# EAGLE design indsensor (EAGLE 7.1.0)
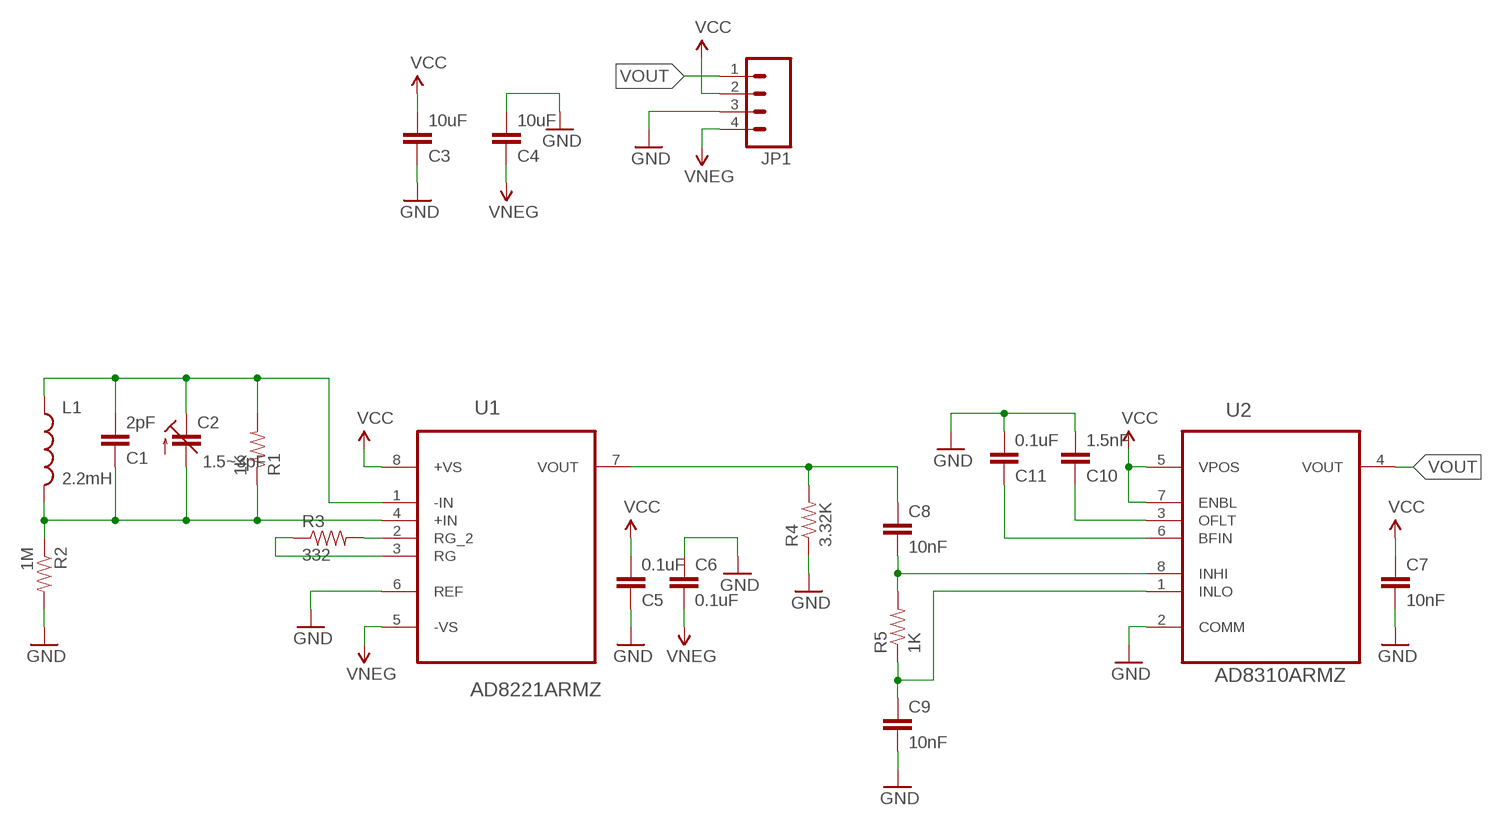
[diagram p0: schematic, sheet 1]

## Parts
C1  2pF  CAP0603-CAP  [0603-CAP]
C2  1.5~3pF  TRIMCAP-TZY  [TRIMCAP-TZY]
C3  10uF  CAP0603-CAP  [0603-CAP]
C4  10uF  CAP0603-CAP  [0603-CAP]
C5  0.1uF  CAP0603-CAP  [0603-CAP]
C6  0.1uF  CAP0603-CAP  [0603-CAP]
C7  10nF  CAP0603-CAP  [0603-CAP]
C8  10nF  CAP0603-CAP  [0603-CAP]
C9  10nF  CAP0603-CAP  [0603-CAP]
C10  1.5nF  CAP0603-CAP  [0603-CAP]
C11  0.1uF  CAP0603-CAP  [0603-CAP]
JP1  M04LOCK  [1X04_LOCK]
L1  2.2mH  LQH43N  [1812]
R1  1K  RESISTOR0603  [0603-RES]
R2  1M  RESISTOR0603  [0603-RES]
R3  332  RESISTOR0603  [0603-RES]
R4  3.32K  RESISTOR0603  [0603-RES]
R5  1K  RESISTOR0603  [0603-RES]
U1  AD8221ARMZ  [SOP65P490X110-8N]
U2  AD8310ARMZ  [SOP65P490X110-8N]

## Nets
10NF: C8.1 R4.2 U1.7(VOUT)
GND: C3.1 C4.2 C5.1 C6.1 C7.2 C9.2 C10.2 C11.2 JP1.3 R2.2 R4.1 U1.6(REF) U2.2(COMM)
N$1: R3.2 U1.2(RG_2)
N$2: R3.1 U1.3(RG)
N$3: C10.1 U2.3(OFLT)
N$4: C8.2 R5.2 U2.8(INHI)
N$5: C9.1 R5.1 U2.1(INLO)
N$7: C1.2 C2.2(E) L1.1 R1.2 U1.1(-IN)
N$8: C11.1 U2.6(BFIN)
N$9: C1.1 C2.1(A) L1.2 R1.1 R2.1 U1.4(+IN)
VCC: C3.2 C5.2 C7.1 JP1.2 U1.8(+VS) U2.5(VPOS) U2.7(ENBL)
VNEG: C4.1 C6.2 JP1.4 U1.5(-VS)
VOUT: JP1.1 U2.4(VOUT)

## Library data of the parts
C1 C3-C11 = SparkFun-Capacitors:CAP: Capacitor Standard 0603 ceramic capacitor, and 0.1" leaded capacitor.
C2 = Custom:TRIMCAP-TZY
JP1 = SparkFun-Connectors:M04: Header 4 Standard 4-pin 0.1" header. Use with straight break away headers (SKU : PRT-00116), right angle break away headers (PRT-00553), swiss pins (PRT-00743), machine pins (PRT-00117), and female headers (PRT-00115). Molex polarized connector foot print use with SKU : PRT-08231 with associated crimp pins and housings. 1MM SMD Version SKU: PRT-10208
L1 = Custom:LQH43N
R1-R5 = SparkFun-Resistors:RESISTOR: Resistor Basic schematic elements and footprints for 0603, 1206, and PTH resistors.
U1 = Analog Devices_By_element14_Batch_1:AD8221ARMZ: Precision Instrumentation Amplifier; MPN: AD8221ARMZ; OC_FARNELL: 1581948; OC_NEWARK: 19M0946; PACKAGE: MSOP-8; SUPPLIER: Analog Devices
U2 = ADI-Phase-2:AD8310ARMZ: 95 dB Logarithmic Amplifier; MPN: AD8310ARMZ; OC_FARNELL: 1661042; OC_NEWARK: 59K6572; PACKAGE: MSOP-8; SUPPLIER: Analog Devices

## Board
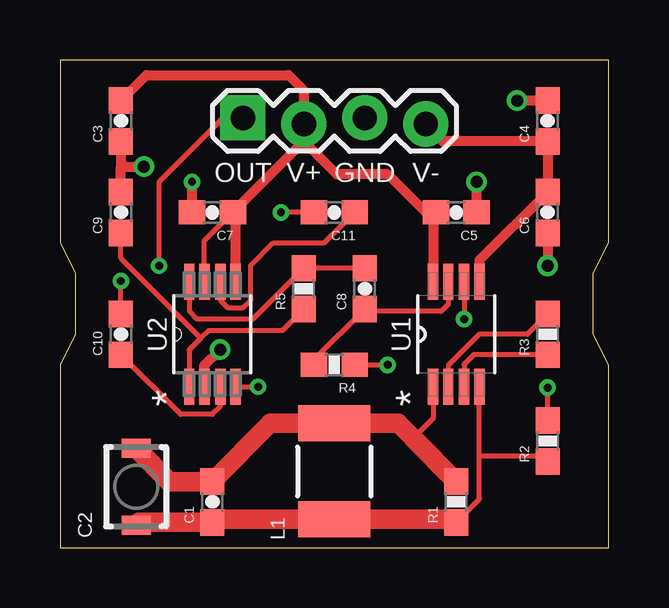
[diagram p1: board, top side]
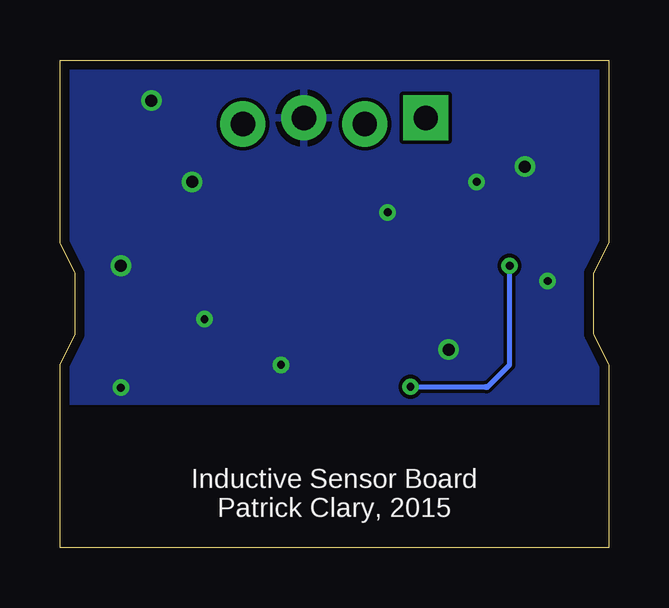
[diagram p2: board, bottom side, seen from below]

Size 22.86 x 20.32 mm. Coordinates in mm from the lower left corner, seen from the top.
Outline: 0,0 22.86,0 22.86,7.62 22.23,8.89 22.23,11.43 22.86,12.7 22.86,20.32 0,20.32 0,12.7 0.64,11.43 0.64,8.89 0,7.62 0,0
Copper layers (1*16): Top 0.0356mm / dielectric 1.5011mm / Bottom 0.0356mm
Design rules "LaenPCBOrder": minimum track width 6mil, minimum drill 13mil, track to track 6mil, track to pad 6mil, pad to pad 6mil, via to via 6mil, smd to smd 6mil, copper to edge 15mil, drill to drill 6mil, minimum pad ring 7mil, minimum via ring 7mil, stop-mask expansion 3mil, vias tented up to drill 0mil, thermal gap 10mil

### Footprints (pad centres in the part's own frame; a part is rotated, then mirrored left to right if it is on the bottom)
0603-CAP = smd 1.1 x 1: 1 -0.85,0; 2 0.85,0
TRIMCAP-TZY = smd 1.2 x 0.8: 1 0,1.6; 2 0,-1.6
1X04_LOCK = drill 1.016 pad 1.88 square: 1 0,0.127 | drill 1.016 pad 1.88: 2 2.54,-0.127; 3 5.08,0.127; 4 7.62,-0.127
1812 = smd 1.501 x 3: 1 -2,0; 2 2,0
0603-RES = smd 1.1 x 1: 1 -0.85,0; 2 0.85,0
SOP65P490X110-8N = smd 1.499 x 0.432: 1 -2.184,0.965; 2 -2.184,0.33; 3 -2.184,-0.33; 4 -2.184,-0.965; 5 2.184,-0.965; 6 2.184,-0.33; 7 2.184,0.33; 8 2.184,0.965

### Placement (x,y rotation side)
C1  6.35,1.91 90 top
C2  3.17,2.54 180 top
C3  2.54,17.78 90 top
C4  20.32,17.78 90 top
C5  16.51,13.97 180 top
C6  20.32,13.97 90 top
C7  6.35,13.97 180 top
C8  12.7,10.79 90 top
C9  2.54,13.97 90 top
C10  2.54,8.89 90 top
C11  11.43,13.97 180 top
JP1  7.62,17.78 0 top
L1  11.43,3.17 270 top
R1  16.51,1.91 90 top
R2  20.32,4.45 90 top
R3  20.32,8.89 90 top
R4  11.43,7.62 180 top
R5  10.16,10.79 90 top
U1  16.51,8.89 90 top
U2  6.35,8.89 90 top

### Tracks (layer width: path | path; a pad name or v marks a point on that pad's centre or on a via)
10NF
  Top 0.203: R4.2 10.58,7.83 C8.1 12.8,9.84 15.88,9.84 16.18,10.15 U1.7
GND  (via drill 0.33, 0.5)
  Top 0.203: R4.1 v13.65,7.62 | R2.2 v20.32,6.67 | C11.2 v9.21,13.97 | C10.2 v2.54,11.11 | U1.6 v16.84,9.53
  Top 0.406: C4.2 v19.05,18.63 | C5.1 v17.36,15.24 | U2.2 6.02,7.61 v6.67,8.26 | C6.1 v20.32,11.75 | C9.2 2.54,15.88 | 2.54,15.88 v3.49,15.88 | C3.1 2.54,15.88 | C7.2 v5.5,15.24
  pour Bottom: 0,6.1 22.86,6.1 22.86,20.32 0,20.32
N$1
  Top 0.203: R3.2 19.47,8.89 17.46,8.89 16.18,7.61 U1.2
N$2
  Top 0.203: R3.1 17.25,8.04 16.84,7.63 U1.3
N$3
  Top 0.203: U2.3 6.67,6.69 6.67,5.87 6.35,5.56 5.02,5.56 C10.1
N$4
  Top 0.203: U2.8 5.4,11.06 5.4,9.84 5.71,9.53 8.04,9.53 R5.2 C8.2
N$5
  Top 0.203: U2.1 5.38,8.24 5.87,8.73 | 5.87,8.73 2.54,12.06 C9.1 | 5.87,8.73 6.19,9.05 9.26,9.05 R5.1
N$7
  Top 0.203: U1.1 15.54,5.38 14.71,4.55
  Top 0.813: R1.2 14.71,4.55 14.09,5.17 L1.1 8.77,5.17 C1.2 4.56,2.75 C2.2
N$8
  Top 0.203: U2.6 6.68,10.31 6.99,10 7.62,10 7.94,10.32 7.94,11.75 8.89,12.7 11.01,12.7 C11.1
N$9
  Top 0.203: R1.1 17.48,2.02 17.48,3.81 | 17.48,3.81 U1.4 | R2.1 20.11,3.81 17.48,3.81 | 2.75,1.05 3.81,1.05
  Top 0.813: C2.1 3.29,1.05 3.81,1.05 C1.1 6.47,1.18 L1.2 16.51,1.18 R1.1
VCC
  Top 0.203: U2.7 6.02,12.79 C7.1 | 15.54,11.11 U1.8
  Top 0.406: U1.8 15.54,13.86 C5.2 15.24,13.97 13.65,15.56 11.53,15.56 10.16,16.93 | U2.5 7.32,13.86 C7.1 10.16,16.93 | 10.16,16.93 JP1.2 10.16,19.05 9.53,19.68 3.6,19.68 C3.2
VNEG
  Top 0.406: U1.5 17.48,11.97 C6.2 C4.1 15.96,16.93 JP1.4
VOUT  (via drill 0.33)
  Top 0.203: U2.4 v8.26,6.71 | JP1.1 6.79,17.91 4.13,15.24 v4.13,11.75
  Bottom 0.203: v8.26,6.71 5.12,6.71 5.08,6.67 4.13,7.62 v4.13,11.75

### Text on the board
tPlace: OUT | V+ | GND | V-
bPlace: Inductive Sensor Board / Patrick Clary, 2015